# Altium project pCard.PrjPcb
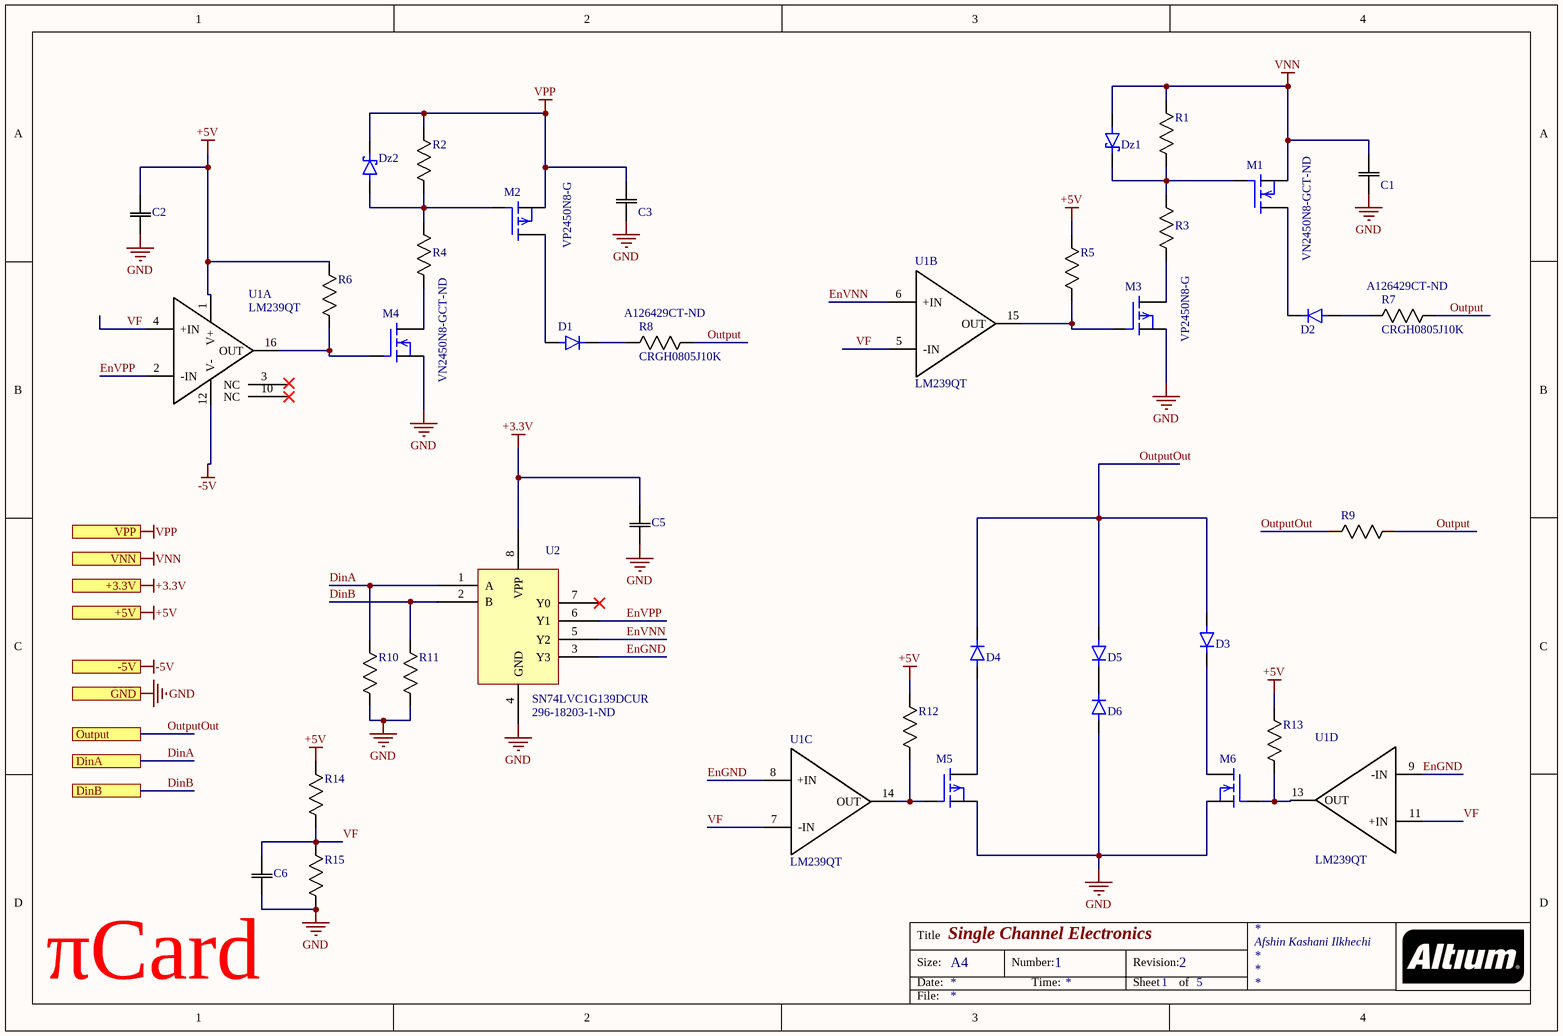
[diagram p0: Sch1SingleChannels.SchDoc]
2 sheets, 37 parts. Net scope: hierarchical (ports join the sheet entries above them; power ports are global).
Board file: pCardBoard.PcbDoc
Sheets:
  Sch1SingleChannels.SchDoc
  Sch3AllChannelControl.SchDoc

## Sheet Sch1SingleChannels.SchDoc: Single Channel Electronics
size A4; Address1: Afshin Kashani Ilkhechi; DocumentNumber: 1; Revision: 2; SheetNumber: 1; SheetTotal: 5

### Parts
C1  885342207014  [C0805]  (value not drawn)
C2  C0805C104Z5VACTU  [C0805]  (value not drawn)
C3  885342207014  [C0805]  (value not drawn)
C5  C0805C104Z5VACTU  [C0805]  (value not drawn)
C6  C0805C104Z5VACTU  [C0805]  (value not drawn)
D1  CD1408-R11000  [CD1408]  (value not drawn)
D2  CD1408-R11000  [CD1408]  (value not drawn)
D3  CD1408-R11000  [CD1408]  (value not drawn)
D4  CD1408-R11000  [CD1408]  (value not drawn)
D5  CD1408-R11000  [CD1408]  (value not drawn)
D6  CD1408-R11000  [CD1408]  (value not drawn)
Dz1  BZT52C5V6STR  [SOD-323]  (value not drawn)
Dz2  BZT52C5V6STR  [SOD-323]  (value not drawn)
M1  Supplier Part Number 1: VN2450N8-GCT-ND  [SOT-89]  (hidden comment: VN2450N8-G)
M2  VP2450N8-G  [SOT-89]
M3  VP2450N8-G  [SOT-89]
M4  Supplier Part Number 1: VN2450N8-GCT-ND  [SOT-89]  (hidden comment: VN2450N8-G)
M5  VP2450N8-G  [SOT-89]  (value not drawn)
M6  VN2450N8-G  [SOT-89]  (value not drawn)
R1  RK73B1ETTP513J  [R0402]  (value not drawn)
R2  RK73B1ETTP513J  [R0402]  (value not drawn)
R3  ERJ-PA3J514V  [R0603]  (value not drawn)
R4  ERJ-PA3J514V  [R0603]  (value not drawn)
R5  RK73B1ETTP103J  [R0402]  (value not drawn)
R6  RK73B1ETTP103J  [R0402]  (value not drawn)
R7  CRGH0805J10K  Supplier Part Number 1: A126429CT-ND  [0805]
R8  CRGH0805J10K  Supplier Part Number 1: A126429CT-ND  [0805]
R9  RMCF0805ZT0R00  [0805]  (value not drawn)
R10  RK73B1ETTP103J  [R0402]  (value not drawn)
R11  RK73B1ETTP103J  [R0402]  (value not drawn)
R12  RK73B1ETTP103J  [R0402]  (value not drawn)
R13  RK73B1ETTP103J  [R0402]  (value not drawn)
R14  RK73B1ETTP103J  [R0402]  (value not drawn)
R15  RK73B1ETTP103J  [R0402]  (value not drawn)
U1  LM239QT  [16-QFN]  (parts A,B,C,D of 4)
U2  SN74LVC1G139DCUR  Supplier Part Number 1: 296-18203-1-ND  [SOP50P310X90-8N]

### Ports
+3.3V, +5V, -5V, DinA, DinB, GND, Output, VNN, VPP

### Nets
+3.3V: C5.2 U2.8(VPP) ; port +3.3V
+5V: C2.2 R5.2 R6.2 R12.2 R13.2 R14.2 U1.1(V+) ; port +5V
-5V: U1.12(V-) ; port -5V
GND: C1.1 C2.1 C3.1 C5.1 C6.1 D6.2 M3.3(S) M4.3(S) M5.3(S) M6.3(S) R10.1 R11.1 R15.1 U2.4(GND) ; port GND
VNN: C1.2 Dz1.2(A) M1.3(S) R1.2 ; port VNN
VPP: C3.2 Dz2.1(K) M2.3(S) R2.2 ; port VPP
DinA: R10.2 U2.1(A) ; port DinA
DinB: R11.2 U2.2(B) ; port DinB
EnGND: U1.8(+IN) U1.9(-IN) U2.3(Y3)
EnVNN: U1.6(+IN) U2.5(Y2)
EnVPP: U1.2(-IN) U2.6(Y1)
Output: R7.2 R8.2 R9.2
OutputOut: D3.2 D4.1 D5.2 R9.1 ; port Output
VF: C6.2 R14.1 R15.2 U1.4(+IN) U1.5(-IN) U1.7(-IN) U1.11(+IN)
NetD1_1: D1.1 R8.1
NetD1_2: D1.2 M2.2(D)
NetD2_1: D2.1 M1.2(D)
NetD2_2: D2.2 R7.1
NetD3_1: D3.1 M6.2(D)
NetD4_2: D4.2 M5.2(D)
NetD5_1: D5.1 D6.1
NetDz1_1: Dz1.1(K) M1.1(G) R1.1 R3.2
NetDz2_2: Dz2.2(A) M2.1(G) R2.1 R4.2
NetM3_1: M3.1(G) R5.1 U1.15(OUT)
NetM3_2: M3.2(D) R3.1
NetM4_1: M4.1(G) R6.1 U1.16(OUT)
NetM4_2: M4.2(D) R4.1
NetM5_1: M5.1(G) R12.1 U1.14(OUT)
NetM6_1: M6.1(G) R13.1 U1.13(OUT)

Not connected (* = marked no-connect by the designer): U1 3(NC) 10(NC)*; U2 7(Y0)*

### Notes on the sheet
- (near C6) πCard
- Title
- Size:
- Date:
- A4
- Number:
- Time:
- Revision:
- Sheet
- of
- File:

### Library data of the parts
C1 C3 = CAP805: 10 nF Cap; Supplier 1: Digi-Key; Supplier Part Number 1: 732-12169-1-ND
C2 C5 C6 = Cap_0805: Supplier 1: Digi-Key; Supplier Part Number 1: 399-1177-1-ND
D1-D6 = CD1408-R11000: Diode Standard 1000V 1A Surface Mount 1408; Supplier 1: Digi-Key; Supplier Part Number 1: CD1408-R11000CT-ND
M1 M4 M6 = VN2450N8-G: N-Channel 500V 250mA (Tj) 1.6W (Ta) Surface Mount TO-243AA (SOT-89); Supplier 1: Digi-Key
  M6: Supplier Part Number 1: VN2450N8-GCT-ND
M2 M3 = VP2450N8-G: P-Channel 500V 160mA (Tj) 1.6W (Ta) Surface Mount TO-243AA (SOT-89); Supplier 1: Digi-Key; Supplier Part Number 1: VP2450N8-GCT-ND
R1 R2 R5 R6 R10-R15 = Res_0402: Supplier 1: Digi-Key
  R1 R2: Supplier Part Number 1: 2019-RK73B1ETTP513JCT-ND
  R5 R6 R10-R15: Supplier Part Number 1: 2019-RK73B1ETTP103JCT-ND
R3 R4 = Res_0603: Supplier 1: Digi-Key; Supplier Part Number 1: P510KBZCT-ND
R7-R9 = Res_0805: Supplier 1: Digi-Key
  R9: Supplier Part Number 1: RMCF0805ZT0R00CT-ND
U1 = LM239QT: Comparator Differential CMOS, DTL, ECL, MOS, Open-Collector, TTL 16-QFN (3x3); Supplier 1: Digi-Key; Supplier Part Number 1: 497-13140-1-ND
Dz1 Dz2 = BZT52C5V6STR: Supplier 1: Digi-Key; Supplier Part Number 1: 1655-BZT52C5V6SCT-ND
M5 = VP2450N8-G: Supplier 1: Digi-Key; Supplier Part Number 1: VP2450N8-GCT-ND
U2 = SN74LVC1G139DCUR: Supplier 1: Digi-Key

## Sheet Sch3AllChannelControl.SchDoc: All Channel Control(ACC)
size A3; Address1: Afshin Kashani Ilkhechi; DocumentNumber: 3; Revision: 2; SheetNumber: 3; SheetTotal: 5
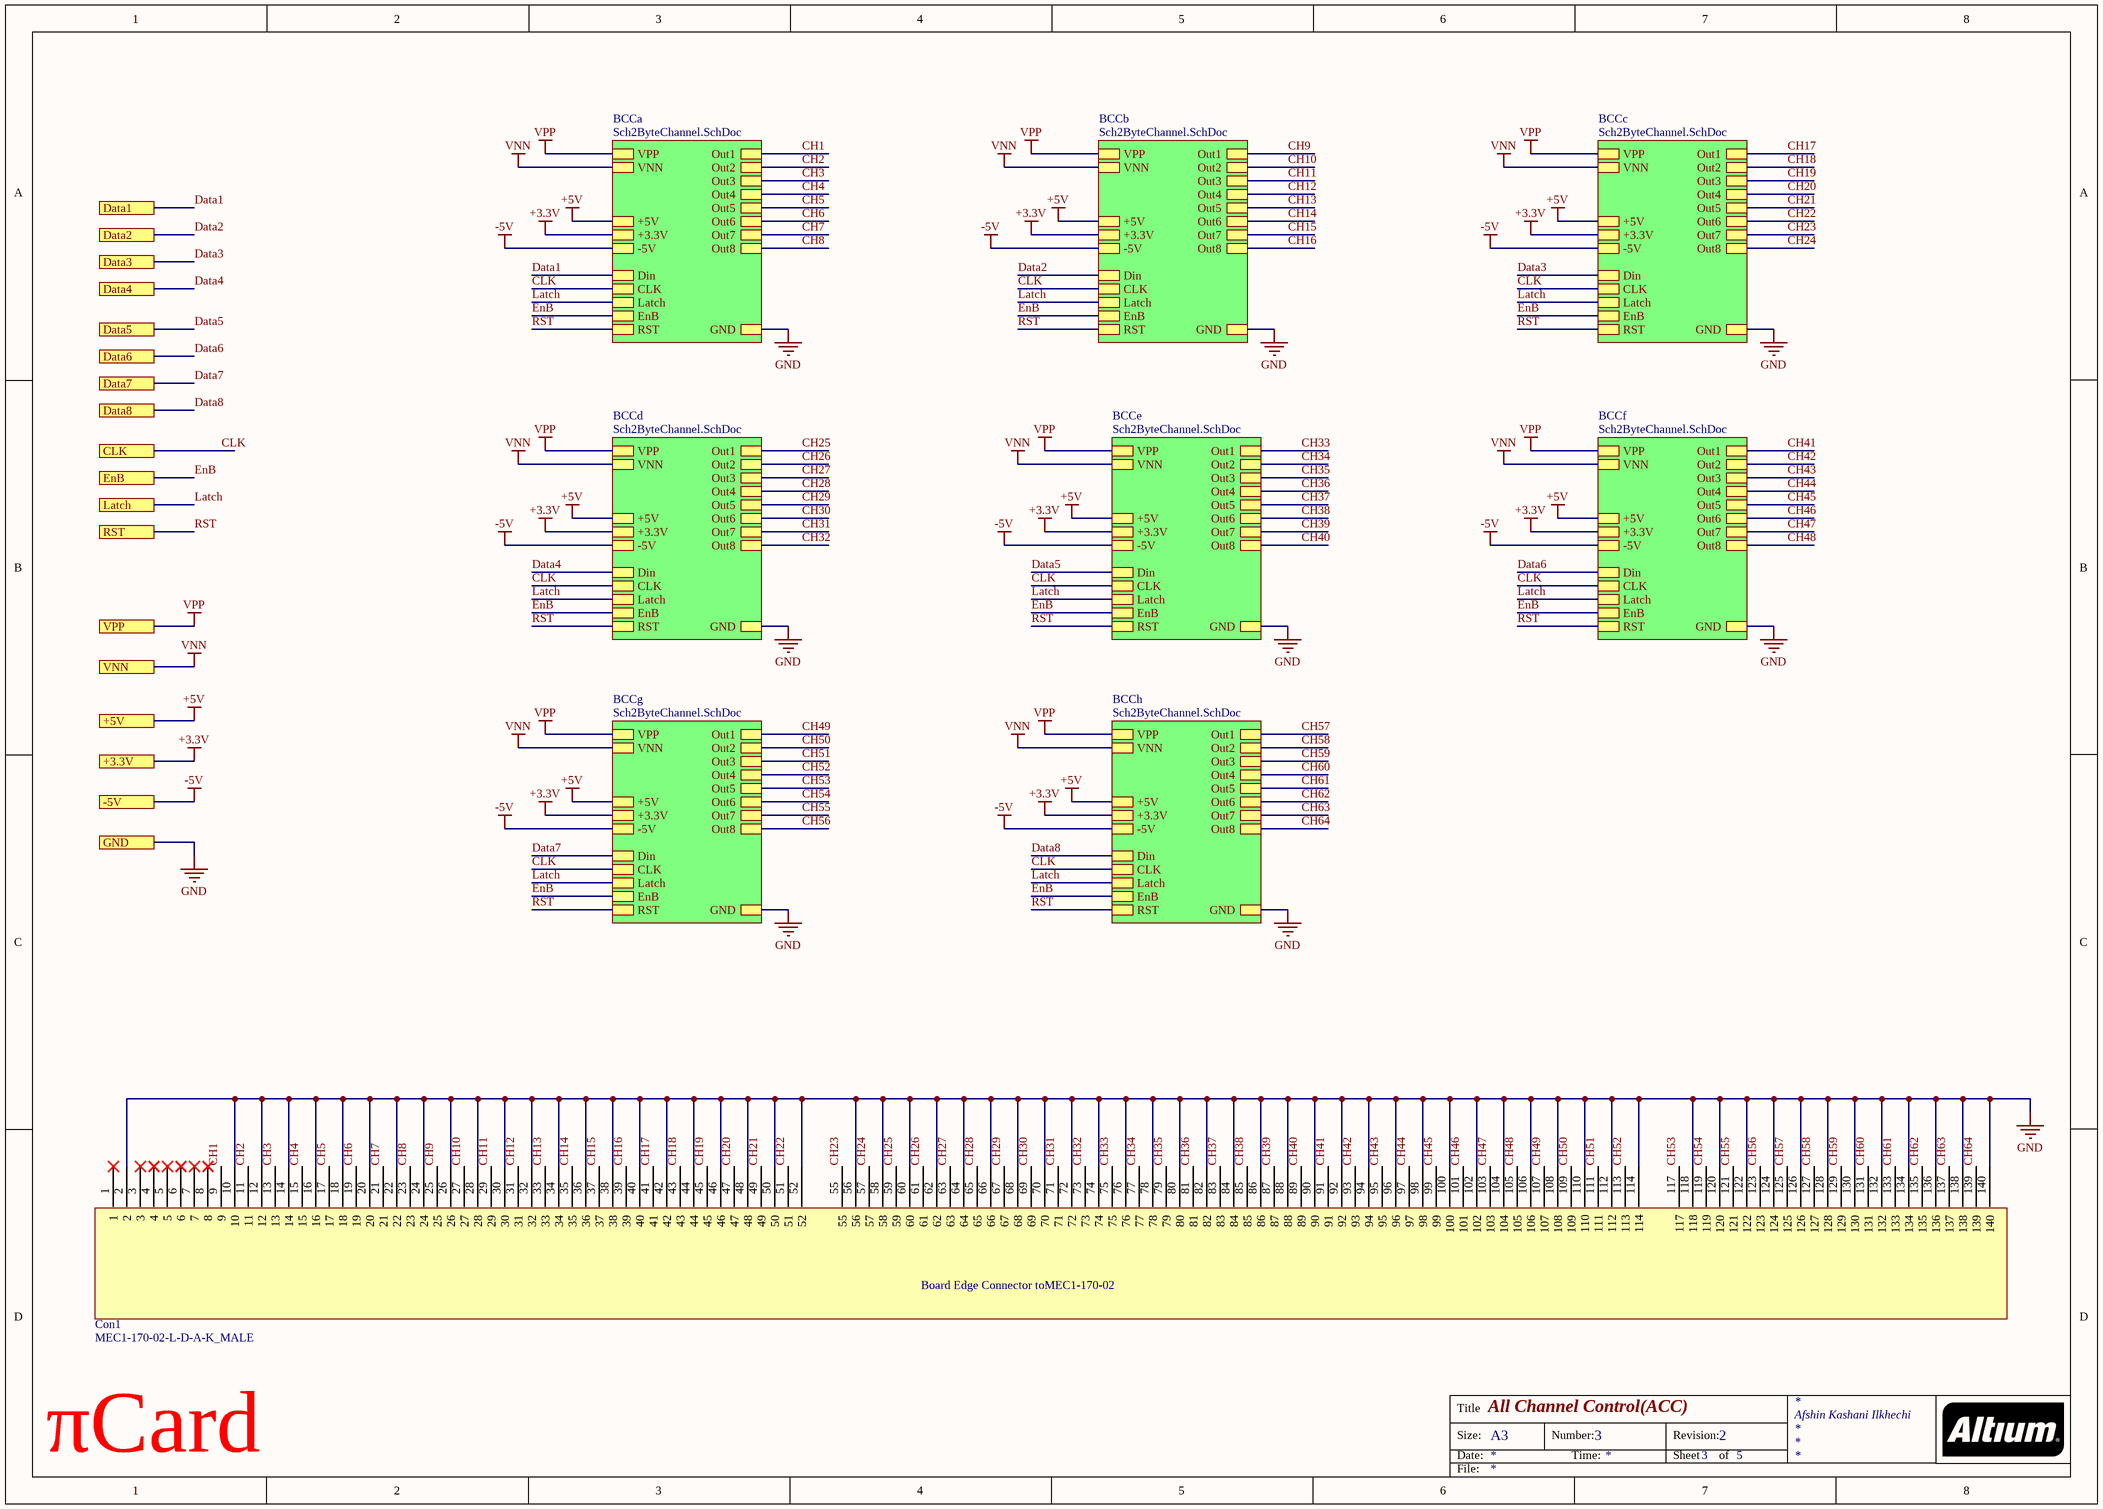
[diagram p1: Sch3AllChannelControl.SchDoc]

### Parts
Con1  MEC1-170-02-L-D-A-K_MALE  [MEC1-170-02-L-D-A-K_MALE]

### Sub-sheets
BCCa = Sch2ByteChannel.SchDoc (file not in this document): VPP, VNN, +3.3V, GND, Din, CLK, EnB, RST, Latch, Out1, Out2, Out3, Out4, Out5, Out6, Out7, Out8, +5V, -5V
BCCb = Sch2ByteChannel.SchDoc (file not in this document): VPP, VNN, +3.3V, GND, Din, CLK, EnB, RST, Latch, Out1, Out2, Out3, Out4, Out5, Out6, Out7, Out8, +5V, -5V
BCCc = Sch2ByteChannel.SchDoc (file not in this document): VPP, VNN, +3.3V, GND, Din, CLK, EnB, RST, Latch, Out1, Out2, Out3, Out4, Out5, Out6, Out7, Out8, +5V, -5V
BCCd = Sch2ByteChannel.SchDoc (file not in this document): VPP, VNN, +3.3V, GND, Din, CLK, EnB, RST, Latch, Out1, Out2, Out3, Out4, Out5, Out6, Out7, Out8, +5V, -5V
BCCe = Sch2ByteChannel.SchDoc (file not in this document): VPP, VNN, +3.3V, GND, Din, CLK, EnB, RST, Latch, Out1, Out2, Out3, Out4, Out5, Out6, Out7, Out8, +5V, -5V
BCCf = Sch2ByteChannel.SchDoc (file not in this document): VPP, VNN, +3.3V, GND, Din, CLK, EnB, RST, Latch, Out1, Out2, Out3, Out4, Out5, Out6, Out7, Out8, +5V, -5V
BCCg = Sch2ByteChannel.SchDoc (file not in this document): VPP, VNN, +3.3V, GND, Din, CLK, EnB, RST, Latch, Out1, Out2, Out3, Out4, Out5, Out6, Out7, Out8, +5V, -5V
BCCh = Sch2ByteChannel.SchDoc (file not in this document): VPP, VNN, +3.3V, GND, Din, CLK, EnB, RST, Latch, Out1, Out2, Out3, Out4, Out5, Out6, Out7, Out8, +5V, -5V

### Ports
+3.3V, +5V, -5V, CLK, Data1, Data2, Data3, Data4, Data5, Data6, Data7, Data8, EnB, GND, Latch, RST, VNN, VPP

### Nets
+3.3V: port +3.3V, sheet BCCa/+3.3V, sheet BCCb/+3.3V, sheet BCCc/+3.3V, sheet BCCd/+3.3V, sheet BCCe/+3.3V, sheet BCCf/+3.3V, sheet BCCg/+3.3V, sheet BCCh/+3.3V
+5V: port +5V, sheet BCCa/+5V, sheet BCCb/+5V, sheet BCCc/+5V, sheet BCCd/+5V, sheet BCCe/+5V, sheet BCCf/+5V, sheet BCCg/+5V, sheet BCCh/+5V
-5V: port -5V, sheet BCCa/-5V, sheet BCCb/-5V, sheet BCCc/-5V, sheet BCCd/-5V, sheet BCCe/-5V, sheet BCCf/-5V, sheet BCCg/-5V, sheet BCCh/-5V
GND: Con1.2 Con1.10 Con1.12 Con1.14 Con1.16 Con1.18 Con1.20 Con1.22 Con1.24 Con1.26 Con1.28 Con1.30 Con1.32 Con1.34 Con1.36 Con1.38 Con1.40 Con1.42 Con1.44 Con1.46 Con1.48 Con1.50 Con1.52 Con1.56 Con1.58 Con1.60 Con1.62 Con1.64 Con1.66 Con1.68 Con1.70 Con1.72 Con1.74 Con1.76 Con1.78 Con1.80 Con1.82 Con1.84 Con1.86 Con1.88 Con1.90 Con1.92 Con1.94 Con1.96 Con1.98 Con1.100 Con1.102 Con1.104 Con1.106 Con1.108 Con1.110 Con1.112 Con1.114 Con1.118 Con1.120 Con1.122 Con1.124 Con1.126 Con1.128 Con1.130 Con1.132 Con1.134 Con1.136 Con1.138 Con1.140 ; port GND, sheet BCCa/GND, sheet BCCb/GND, sheet BCCc/GND, sheet BCCd/GND, sheet BCCe/GND, sheet BCCf/GND, sheet BCCg/GND, sheet BCCh/GND
VNN: port VNN, sheet BCCa/VNN, sheet BCCb/VNN, sheet BCCc/VNN, sheet BCCd/VNN, sheet BCCe/VNN, sheet BCCf/VNN, sheet BCCg/VNN, sheet BCCh/VNN
VPP: port VPP, sheet BCCa/VPP, sheet BCCb/VPP, sheet BCCc/VPP, sheet BCCd/VPP, sheet BCCe/VPP, sheet BCCf/VPP, sheet BCCg/VPP, sheet BCCh/VPP
CH1: Con1.9 ; sheet BCCa/Out1
CH2: Con1.11 ; sheet BCCa/Out2
CH3: Con1.13 ; sheet BCCa/Out3
CH4: Con1.15 ; sheet BCCa/Out4
CH5: Con1.17 ; sheet BCCa/Out5
CH6: Con1.19 ; sheet BCCa/Out6
CH7: Con1.21 ; sheet BCCa/Out7
CH8: Con1.23 ; sheet BCCa/Out8
CH9: Con1.25 ; sheet BCCb/Out1
CH10: Con1.27 ; sheet BCCb/Out2
CH11: Con1.29 ; sheet BCCb/Out3
CH12: Con1.31 ; sheet BCCb/Out4
CH13: Con1.33 ; sheet BCCb/Out5
CH14: Con1.35 ; sheet BCCb/Out6
CH15: Con1.37 ; sheet BCCb/Out7
CH16: Con1.39 ; sheet BCCb/Out8
CH17: Con1.41 ; sheet BCCc/Out1
CH18: Con1.43 ; sheet BCCc/Out2
CH19: Con1.45 ; sheet BCCc/Out3
CH20: Con1.47 ; sheet BCCc/Out4
CH21: Con1.49 ; sheet BCCc/Out5
CH22: Con1.51 ; sheet BCCc/Out6
CH23: Con1.55 ; sheet BCCc/Out7
CH24: Con1.57 ; sheet BCCc/Out8
CH25: Con1.59 ; sheet BCCd/Out1
CH26: Con1.61 ; sheet BCCd/Out2
CH27: Con1.63 ; sheet BCCd/Out3
CH28: Con1.65 ; sheet BCCd/Out4
CH29: Con1.67 ; sheet BCCd/Out5
CH30: Con1.69 ; sheet BCCd/Out6
CH31: Con1.71 ; sheet BCCd/Out7
CH32: Con1.73 ; sheet BCCd/Out8
CH33: Con1.75 ; sheet BCCe/Out1
CH34: Con1.77 ; sheet BCCe/Out2
CH35: Con1.79 ; sheet BCCe/Out3
CH36: Con1.81 ; sheet BCCe/Out4
CH37: Con1.83 ; sheet BCCe/Out5
CH38: Con1.85 ; sheet BCCe/Out6
CH39: Con1.87 ; sheet BCCe/Out7
CH40: Con1.89 ; sheet BCCe/Out8
CH41: Con1.91 ; sheet BCCf/Out1
CH42: Con1.93 ; sheet BCCf/Out2
CH43: Con1.95 ; sheet BCCf/Out3
CH44: Con1.97 ; sheet BCCf/Out4
CH45: Con1.99 ; sheet BCCf/Out5
CH46: Con1.101 ; sheet BCCf/Out6
CH47: Con1.103 ; sheet BCCf/Out7
CH48: Con1.105 ; sheet BCCf/Out8
CH49: Con1.107 ; sheet BCCg/Out1
CH50: Con1.109 ; sheet BCCg/Out2
CH51: Con1.111 ; sheet BCCg/Out3
CH52: Con1.113 ; sheet BCCg/Out4
CH53: Con1.117 ; sheet BCCg/Out5
CH54: Con1.119 ; sheet BCCg/Out6
CH55: Con1.121 ; sheet BCCg/Out7
CH56: Con1.123 ; sheet BCCg/Out8
CH57: Con1.125 ; sheet BCCh/Out1
CH58: Con1.127 ; sheet BCCh/Out2
CH59: Con1.129 ; sheet BCCh/Out3
CH60: Con1.131 ; sheet BCCh/Out4
CH61: Con1.133 ; sheet BCCh/Out5
CH62: Con1.135 ; sheet BCCh/Out6
CH63: Con1.137 ; sheet BCCh/Out7
CH64: Con1.139 ; sheet BCCh/Out8
CLK: port CLK, sheet BCCa/CLK, sheet BCCb/CLK, sheet BCCc/CLK, sheet BCCd/CLK, sheet BCCe/CLK, sheet BCCf/CLK, sheet BCCg/CLK, sheet BCCh/CLK
Data1: port Data1, sheet BCCa/Din
Data2: port Data2, sheet BCCb/Din
Data3: port Data3, sheet BCCc/Din
Data4: port Data4, sheet BCCd/Din
Data5: port Data5, sheet BCCe/Din
Data6: port Data6, sheet BCCf/Din
Data7: port Data7, sheet BCCg/Din
Data8: port Data8, sheet BCCh/Din
EnB: port EnB, sheet BCCa/EnB, sheet BCCb/EnB, sheet BCCc/EnB, sheet BCCd/EnB, sheet BCCe/EnB, sheet BCCf/EnB, sheet BCCg/EnB, sheet BCCh/EnB
Latch: port Latch, sheet BCCa/Latch, sheet BCCb/Latch, sheet BCCc/Latch, sheet BCCd/Latch, sheet BCCe/Latch, sheet BCCf/Latch, sheet BCCg/Latch, sheet BCCh/Latch
RST: port RST, sheet BCCa/RST, sheet BCCb/RST, sheet BCCc/RST, sheet BCCd/RST, sheet BCCe/RST, sheet BCCf/RST, sheet BCCg/RST, sheet BCCh/RST

Not connected (* = marked no-connect by the designer): Con1 1* 3* 4* 5* 6* 7* 8*

### Notes on the sheet
- πCard
- Title
- Size:
- Date:
- A3
- Number:
- Time:
- Revision:
- Sheet
- of
- File:
- (in symbol MEC1-170-02-L-D-A-K_MALE) Board Edge Connector toMEC1-170-02

## Nets that join several sheets
GND: Sch1SingleChannels (14 pins), Sch3AllChannelControl (65 pins)